# EAGLE schematic 1z16_7seg-eagle (EAGLE 6.5.0)
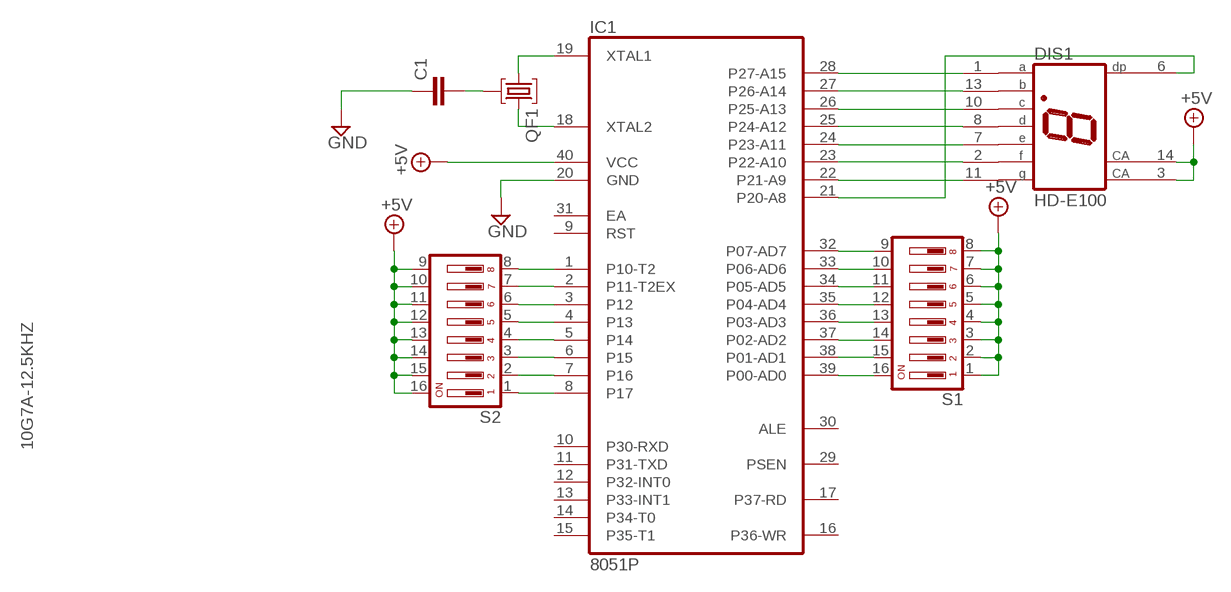
[diagram p0: schematic, sheet 1]

## Parts
C1  C2,5-3  [C2.5-3]
DIS1  HD-E100  [HDSP-I]
IC1  8051P  [DIL40]
QF1  10G7A-12.5KHZ  [HC49U]
S1  DA08  [DA-08]
S2  DA08  [DA-08]

## Nets
+5V: DIS1.3(CA) DIS1.14(CA) IC1.40(VCC) S1.1 S1.2 S1.3 S1.4 S1.5 S1.6 S1.7 S1.8 S2.9 S2.10 S2.11 S2.12 S2.13 S2.14 S2.15 S2.16
GND: C1.1 IC1.20(GND)
N$1: IC1.32(P07-AD7) S1.9
N$2: IC1.33(P06-AD6) S1.10
N$3: IC1.34(P05-AD5) S1.11
N$4: IC1.35(P04-AD4) S1.12
N$5: IC1.36(P03-AD3) S1.13
N$6: IC1.37(P02-AD2) S1.14
N$7: IC1.38(P01-AD1) S1.15
N$8: IC1.39(P00-AD0) S1.16
N$9: IC1.8(P17) S2.1
N$10: IC1.7(P16) S2.2
N$11: IC1.6(P15) S2.3
N$12: IC1.5(P14) S2.4
N$13: IC1.4(P13) S2.5
N$14: IC1.3(P12) S2.6
N$15: IC1.2(P11-T2EX) S2.7
N$16: IC1.1(P10-T2) S2.8
N$17: IC1.18(XTAL2) QF1.3
N$18: IC1.19(XTAL1) QF1.1
N$19: C1.2 QF1.2
N$20: DIS1.1(A) IC1.28(P27-A15)
N$21: DIS1.13(B) IC1.27(P26-A14)
N$22: DIS1.10(C) IC1.26(P25-A13)
N$23: DIS1.8(D) IC1.25(P24-A12)
N$24: DIS1.7(E) IC1.24(P23-A11)
N$25: DIS1.2(F) IC1.23(P22-A10)
N$26: DIS1.11(G) IC1.22(P21-A9)
N$27: DIS1.6(DP) IC1.21(P20-A8)
Unconnected: IC1.9(RST) IC1.10(P30-RXD) IC1.11(P31-TXD) IC1.12(P32-INT0) IC1.13(P33-INT1) IC1.14(P34-T0) IC1.15(P35-T1) IC1.16(P36-WR) IC1.17(P37-RD) IC1.29(PSEN) IC1.30(ALE) IC1.31(EA)

## Library data of the parts
C1 = capacitor-wima:C: CAPACITOR naming: grid - package width
DIS1 = display-hp:HD-E100: LED DISPLAY 1-character 7 segment, decimal point left; OC_FARNELL: unknown; OC_NEWARK: unknown
IC1 = micro-intel:8051: (CHMOS) SINGLE-CHIP 8-BIT MICROCONTROLLER 80C31BH / 80C51 BH / 87C51 MCS 51 Source: http://apps.intel.com .. 27041907.pdf; OC_FARNELL: unknown; OC_NEWARK: unknown
QF1 = crystal:10G: Monolithic Crystal Filters Source: www.golledge.com; OC_FARNELL: unknown; OC_NEWARK: unknown
S1 S2 = switch-dil:DA08: DIL/CODE SWITCH; MPN: MCDA08; OC_FARNELL: 9471561; OC_NEWARK: 26M1092